# EAGLE design shield passage vitesse (EAGLE 9.2.1)
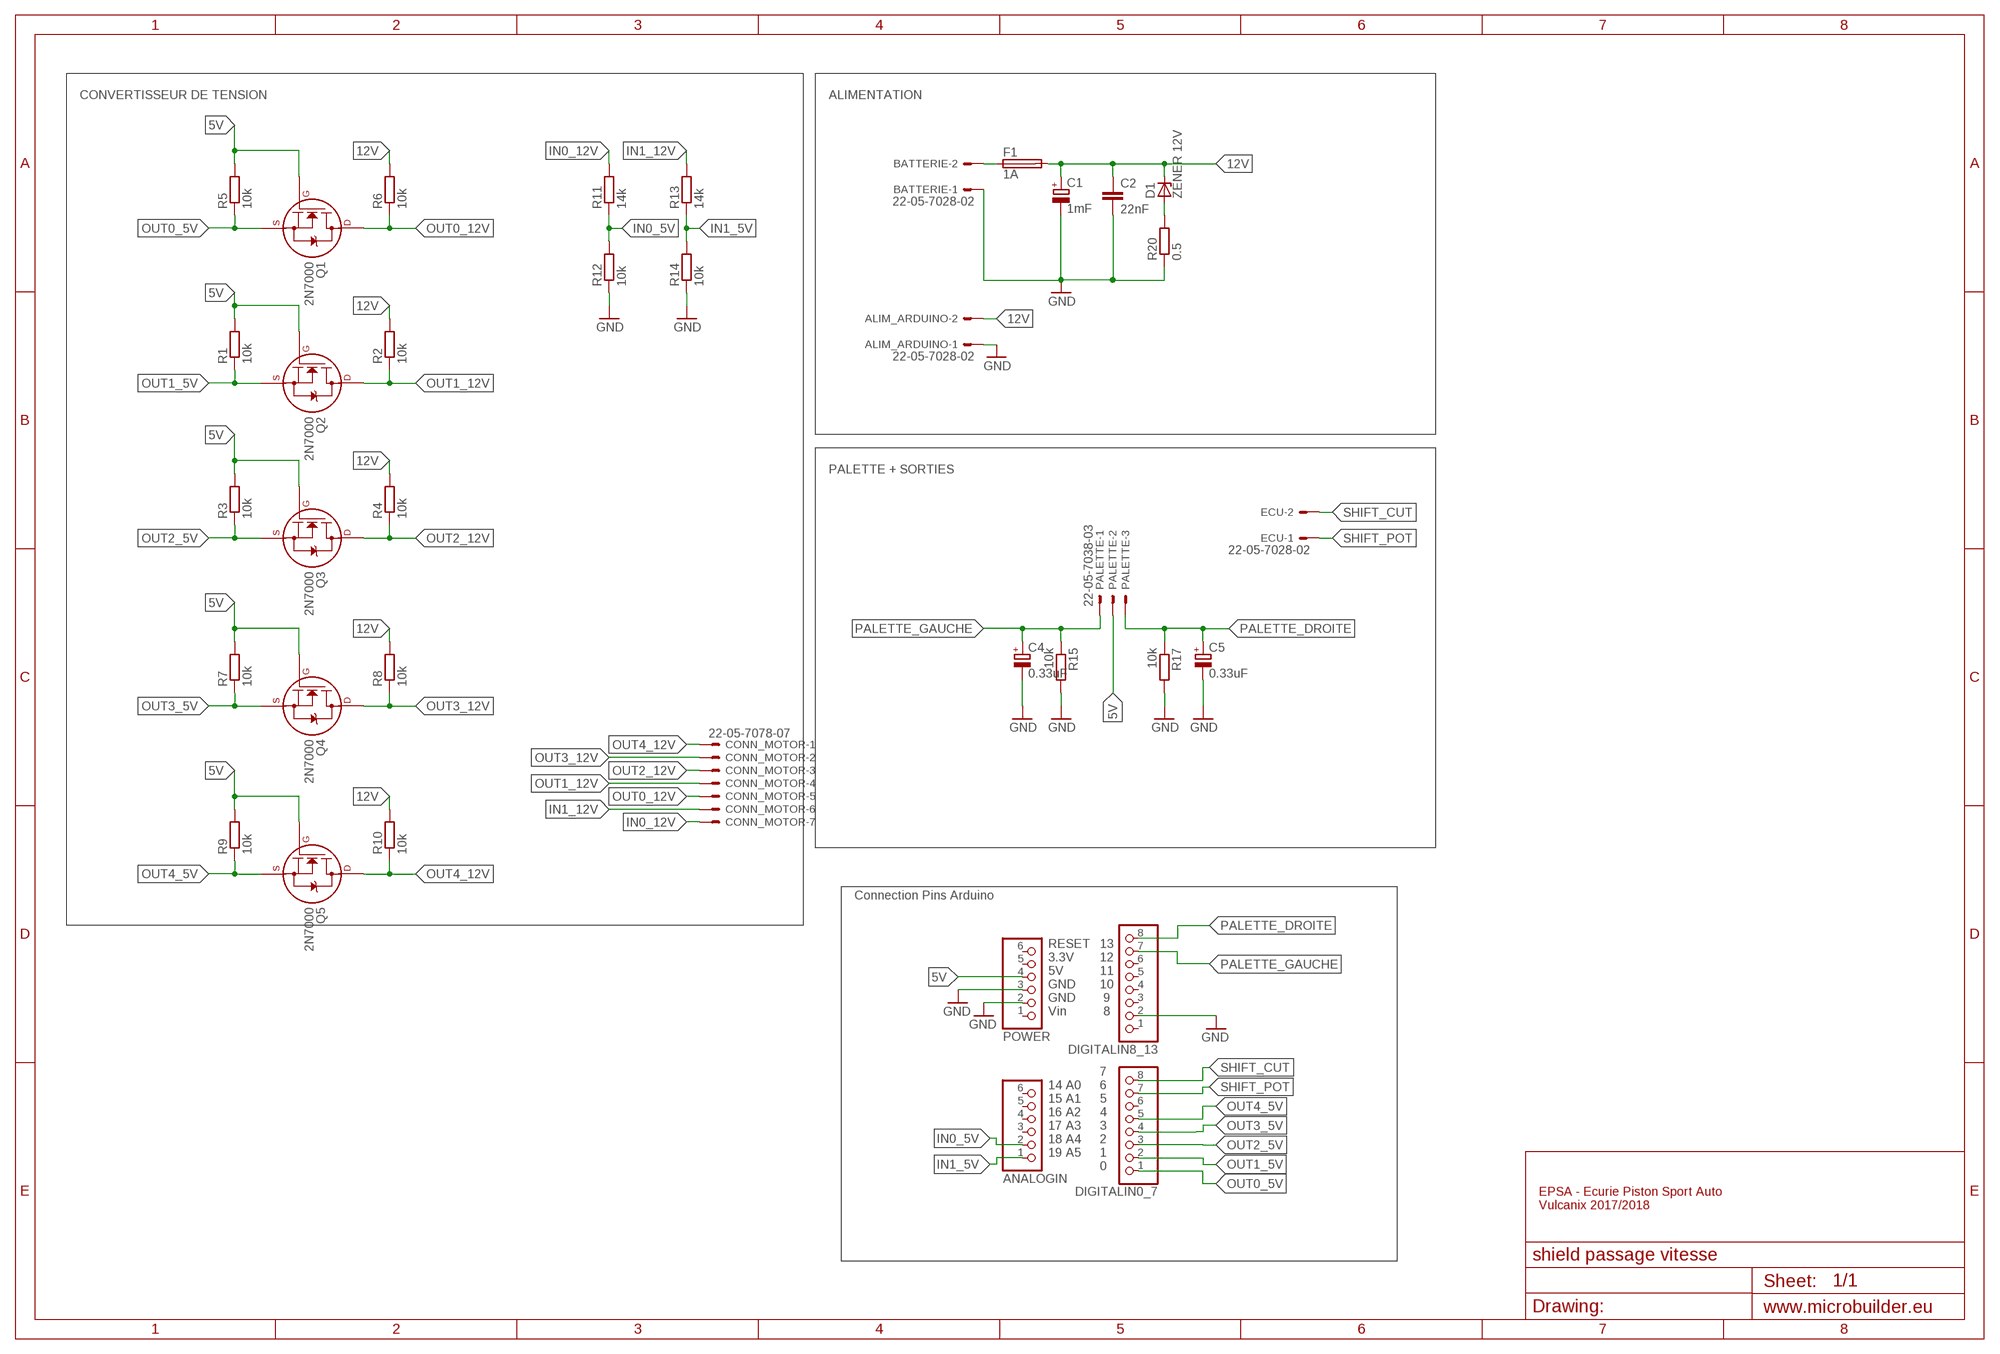
[diagram p0: schematic, sheet 1]

## Parts
ALIM_ARDUINO  22-05-7028-02  [7395-02]
ANALOGIN  PINHD-1X6CB  [1X06-CLEANBIG]
BATTERIE  22-05-7028-02  [7395-02]
C1  1mF  CPOL-EUE7.5-16  [E7,5-16]
C2  22nF  C-EU025-025X050  [C025-025X050]
C4  0.33uF  CPOL-EUE2,5-6E  [E2,5-6E]
C5  0.33uF  CPOL-EUE2,5-6E  [E2,5-6E]
CONN_MOTOR  22-05-7078-07  [7395-07]
D1  ZENER 12V  ZENER-DIODEDO41Z10  [DO41Z10]
DIGITALIN0_7  PINHD-1X8CLEANBIG  [1X08-CLEANBIG]
DIGITALIN8_13  PINHD-1X8CLEANBIG  [1X08-CLEANBIG]
ECU  22-05-7028-02  [7395-02]
F1  1A  SH25  [SH25]
PALETTE  22-05-7038-03  [7395-03]
POWER  PINHD-1X6CB  [1X06-CLEANBIG]
Q1  2N7000  2N7000_TO92  [TO-92]
Q2  2N7000  2N7000_TO92  [TO-92]
Q3  2N7000  2N7000_TO92  [TO-92]
Q4  2N7000  2N7000_TO92  [TO-92]
Q5  2N7000  2N7000_TO92  [TO-92]
R1  10k  R-EU_0204/7  [0204/7]
R2  10k  R-EU_0204/7  [0204/7]
R3  10k  R-EU_0204/7  [0204/7]
R4  10k  R-EU_0204/7  [0204/7]
R5  10k  R-EU_0204/7  [0204/7]
R6  10k  R-EU_0204/7  [0204/7]
R7  10k  R-EU_0204/7  [0204/7]
R8  10k  R-EU_0204/7  [0204/7]
R9  10k  R-EU_0204/7  [0204/7]
R10  10k  R-EU_0204/7  [0204/7]
R11  14k  R-EU_0204/7  [0204/7]
R12  10k  R-EU_0204/7  [0204/7]
R13  14k  R-EU_0204/7  [0204/7]
R14  10k  R-EU_0204/7  [0204/7]
R15  10k  R-EU_0204/7  [0204/7]
R17  10k  R-EU_0204/7  [0204/7]
R20  0.5  R-EU_0309/12  [0309/12]

## Nets
5V: PALETTE.2 POWER.4 Q1.2(G) Q2.2(G) Q3.2(G) Q4.2(G) Q5.2(G) R1.2 R3.2 R5.2 R7.2 R9.2
12V [Vcc12]: ALIM_ARDUINO.2 C1.+ C2.1 D1.C F1.2 R2.2 R4.2 R6.2 R8.2 R10.2
GND: ALIM_ARDUINO.1 BATTERIE.1 C1.- C2.2 C4.- C5.- DIGITALIN8_13.2 POWER.2 POWER.3 R12.1 R14.1 R15.2 R17.2 R20.1
IN0_5V: ANALOGIN.2 R11.1 R12.2
IN0_12V: CONN_MOTOR.7 R11.2
IN1_5V: ANALOGIN.1 R13.1 R14.2
IN1_12V: CONN_MOTOR.6 R13.2
N$1: BATTERIE.2 F1.1
N$4: D1.A R20.2
OUT0_5V: DIGITALIN0_7.1 Q1.1(S) R5.1
OUT0_12V: CONN_MOTOR.5 Q1.3(D) R6.1
OUT1_5V: DIGITALIN0_7.2 Q2.1(S) R1.1
OUT1_12V: CONN_MOTOR.4 Q2.3(D) R2.1
OUT2_5V: DIGITALIN0_7.3 Q3.1(S) R3.1
OUT2_12V: CONN_MOTOR.3 Q3.3(D) R4.1
OUT3_5V: DIGITALIN0_7.4 Q4.1(S) R7.1
OUT3_12V: CONN_MOTOR.2 Q4.3(D) R8.1
OUT4_5V: DIGITALIN0_7.5 Q5.1(S) R9.1
OUT4_12V: CONN_MOTOR.1 Q5.3(D) R10.1
PALETTE_DROITE: C5.+ DIGITALIN8_13.8 PALETTE.3 R17.1
PALETTE_GAUCHE: C4.+ DIGITALIN8_13.7 PALETTE.1 R15.1
SHIFT_CUT: DIGITALIN0_7.8 ECU.2
SHIFT_POT: DIGITALIN0_7.7 ECU.1
Unconnected: ANALOGIN.3 ANALOGIN.4 ANALOGIN.5 ANALOGIN.6 DIGITALIN0_7.6 DIGITALIN8_13.1 DIGITALIN8_13.3 DIGITALIN8_13.4 DIGITALIN8_13.5 DIGITALIN8_13.6 POWER.1 POWER.5 POWER.6

## Notes on the sheet
- CONVERTISSEUR DE TENSION | ALIMENTATION
- PALETTE + SORTIES
- Connection Pins Arduino
- RESET
  3.3V
  5V
  GND
  GND
  Vin
- 13
  12
  11
  10
   9
   8
- 14 A0
  15 A1
  16 A2
  17 A3
  18 A4
  19 A5
- 7
  6
  5
  4
  3
  2
  1
  0
- EPSA - Ecurie Piston Sport Auto
  Vulcanix 2017/2018

## Library data of the parts
ALIM_ARDUINO BATTERIE ECU = EP_molex_6410_7395:22-?-02: CONNECTOR wire to board 2.54 mm (.1 inch) pitch header
ANALOGIN POWER = carduino:PINHD-1X6: PIN HEADER
C1 C4 C5 = rcl:CPOL-EU: POLARIZED CAPACITOR, European symbol
C2 = rcl:C-EU: CAPACITOR, European symbol
CONN_MOTOR = EP_molex_6410_7395:22-?-07: CONNECTOR wire to board 2.54 mm (.1 inch) pitch header
D1 = diode:ZENER-DIODE: Z-Diode
DIGITALIN0_7 DIGITALIN8_13 = carduino:PINHD-1X8: PIN HEADER
F1 = fuse:SH25: FUSE HOLDER grid 25 mm, OGN0031 8211, Schurter (Buerklin); MF: SCHURTER; MPN: 0031.8211; OC_FARNELL: 1162741; OC_NEWARK: 96B9380
PALETTE = EP_molex_6410_7395:22-?-03: CONNECTOR wire to board 2.54 mm (.1 inch) pitch header
Q1-Q5 = transistors:2N700*: 2N7000, 2N7002, NDS7002A N-channel enhancement mode MOSFET
R1-R15 R17 R20 = resistor:R-EU_: RESISTOR, European symbol

## Net classes
0 default: width 0.61 mm
1 Vcc12: width 1.016 mm

## Board
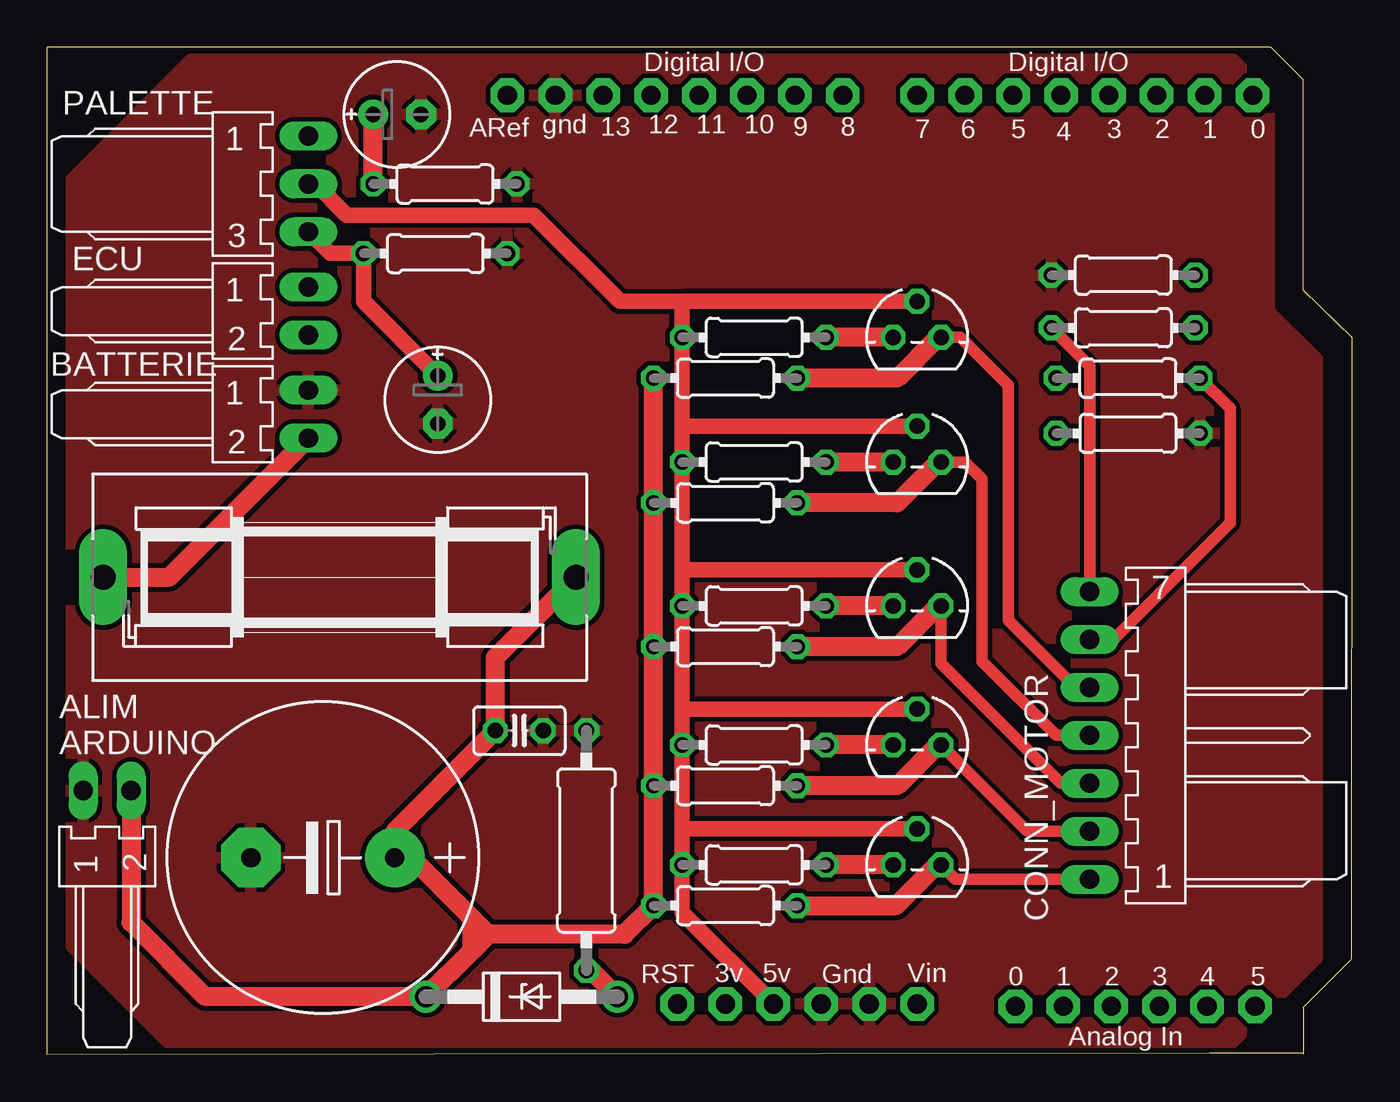
[diagram p1: board, top side]
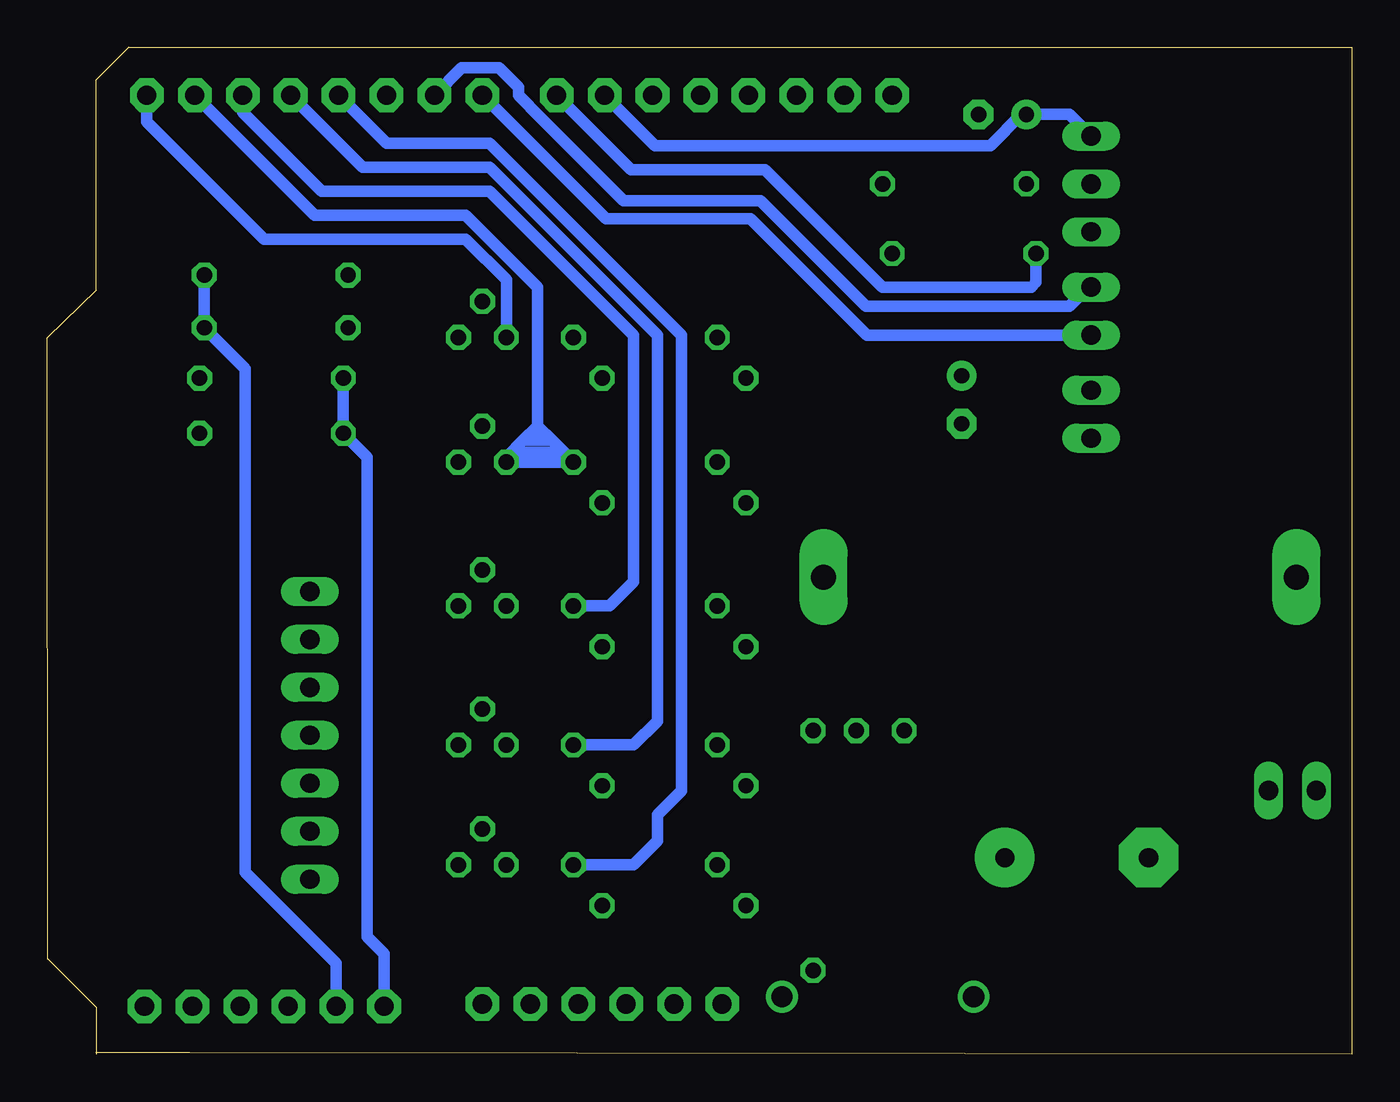
[diagram p2: board, bottom side, seen from below]

Size 69.16 x 53.35 mm. Coordinates in mm from the lower left corner, seen from the top.
Outline: 69.13,5.05 69.13,5.05
Outline: 69.13,5.05 69.16,37.95 66.55,40.49 66.55,51.63 64.83,53.35 0,53.35 0,0 61.6,0.09 66.58,0.08
Outline: 69.13,5.05 66.55,2.5 66.57,0
Copper layers (1*16): Top 0.035mm / dielectric 1.5mm / Bottom 0.035mm
Design rules "default *": minimum track width 10mil, minimum drill 19mil, track to track 10mil, track to pad 10mil, pad to pad 0mil, via to via 10mil, smd to smd 0mil, copper to edge 10mil, drill to drill 8mil, minimum pad ring 10mil, minimum via ring 8mil, stop-mask expansion 4mil, vias tented up to drill 0mil, thermal gap 10mil

### Footprints (pad centres in the part's own frame; a part is rotated, then mirrored left to right if it is on the bottom)
7395-02 = drill 1.016 long: 1 1.27,0; 2 -1.27,0
1X06-CLEANBIG = drill 1.016 pad 1.778 octagon: 1 -6.35,0; 2 -3.81,0; 3 -1.27,0; 4 1.27,0; 5 3.81,0; 6 6.35,0
E7,5-16 = drill 1.016 pad 3.15: + -3.81,0 | drill 1.016 pad 3.15 octagon: - 3.81,0
C025-025X050 = drill 0.813 octagon: 1 -1.27,0; 2 1.27,0
E2,5-6E = drill 0.813 pad 1.575: + -1.27,0 | drill 0.813 pad 1.575 octagon: - 1.27,0
7395-07 = drill 1.016 long: 1 7.62,0; 2 5.08,0; 3 2.54,0; 4 0,0; 5 -2.54,0; 6 -5.08,0; 7 -7.62,0
DO41Z10 = drill 1.118: A 5.08,0; C -5.08,0
1X08-CLEANBIG = drill 1.016 pad 1.778 octagon: 1 -8.89,0; 2 -6.35,0; 3 -3.81,0; 4 -1.27,0; 5 1.27,0; 6 3.81,0; 7 6.35,0; 8 8.89,0
SH25 = drill 1.321 pad 2.54 long: 1 -12.522,0; 2 12.522,0
7395-03 = drill 1.016 long: 1 2.54,0; 2 0,0; 3 -2.54,0
TO-92 = drill 0.813 octagon: 1 -1.27,0; 2 0,1.905; 3 1.27,0
0204/7 = drill 0.813 octagon: 1 -3.81,0; 2 3.81,0
0309/12 = drill 0.813 octagon: 1 -6.35,0; 2 6.35,0

### Placement (x,y rotation side)
ALIM_ARDUINO  3.17,13.98 180 top
ANALOGIN  57.65,2.55 0 top
BATTERIE  13.84,33.91 90 top
C1  14.6,10.42 180 top
C2  25.02,17.15 0 top
C4  18.54,49.79 0 top
C5  20.7,34.68 270 top
CONN_MOTOR  55.24,16.9 270 top
D1  25.14,3.05 0 top
DIGITALIN0_7  54.99,50.81 180 top
DIGITALIN8_13  33.27,50.81 0 top
ECU  13.84,39.38 90 top
F1  15.49,25.28 0 top
PALETTE  13.84,46.11 90 top
POWER  39.75,2.67 180 top
Q1  46.1,37.98 0 top
Q2  46.1,31.37 0 top
Q3  46.1,23.75 0 top
Q4  46.1,16.39 0 top
Q5  46.1,10.04 0 top
R1  37.46,31.37 180 top
R2  35.94,29.22 180 top
R3  37.46,23.75 180 top
R4  35.94,21.6 180 top
R5  37.46,37.98 180 top
R6  35.94,35.82 180 top
R7  37.46,16.39 180 top
R8  35.94,14.23 180 top
R9  37.46,10.04 180 top
R10  35.94,7.88 180 top
R11  57.02,38.49 180 top
R12  57.02,41.28 0 top
R13  57.27,35.82 0 top
R14  57.27,32.9 180 top
R15  21.08,46.11 0 top
R17  20.57,42.42 0 top
R20  28.57,10.8 270 top

### Tracks (layer width: path | path; a pad name or v marks a point on that pad's centre or on a via)
5V
  Top 0.813: Q1.2 33.65,39.88 | 33.65,33.03 R5.2 33.65,39.88 | 33.65,33.03 R1.2 33.65,25.41 | 33.65,25.41 R3.2 33.65,18.42 | 33.65,18.42 R7.2 33.65,12.07 | 33.65,12.07 R9.2 33.65,7.5 POWER.4 | 33.65,39.88 30.35,39.88 25.78,44.46 15.87,44.46 14.22,46.11 PALETTE.2 | 33.65,25.41 33.91,25.66 Q3.2 | 33.65,18.42 33.78,18.29 Q4.2 | 33.65,12.07 33.78,11.94 Q5.2 | 33.65,33.03 33.91,33.28 Q2.2
12V
  Top 1.016: ALIM_ARDUINO.2 4.44,6.99 8.38,3.05 D1.C 22.48,5.47 | 28.19,25.1 F1.2 23.75,21.01 C2.1 18.41,11.82 C1.+ 18.41,10.8 18.92,10.8 22.48,7.24 | R6.2 R2.2 R4.2 R8.2 R10.2 30.6,6.36 23.36,6.36 | 23.36,6.36 22.48,5.47 | 23.36,6.36 22.48,7.24 | 22.48,7.24 22.48,5.47
GND
  pour Top: 6.35,0.64 1.27,5.72 1.27,46.36 7.62,52.71 62.86,52.71 64.77,50.81 64.77,39.38 67.31,36.84 67.31,5.09 62.86,0.64
IN0_5V
  Bottom 0.61: ANALOGIN.2 53.84,4.83 58.67,9.66 58.67,36.33 R11.1 R12.2
IN0_12V
  Top 0.61: R11.2 55.24,36.45 CONN_MOTOR.7
IN1_5V
  Bottom 0.61: R13.1 R14.2 52.19,31.63 52.19,6.23 51.3,5.34 ANALOGIN.1
IN1_12V
  Top 0.61: CONN_MOTOR.6 56.51,21.98 62.68,28.15 62.68,34.22 R13.2
N$1
  Top 1.016: BATTERIE.2 6.47,25.28 F1.1
N$4
  Top 1.016: D1.A 28.83,4.45 R20.2
OUT0_5V
  Top 1.016: Q1.1 R5.1
  Bottom 0.61: DIGITALIN0_7.1 63.88,49.41 57.65,43.19 46.99,43.19 44.83,41.03 Q1.1
OUT0_12V
  Top 0.61: CONN_MOTOR.5 54.48,19.44 50.92,22.99 50.92,35.44 48.38,37.98 Q1.3
  Top 1.016: R6.1 45.04,35.82 47.2,37.98 Q1.3
OUT1_5V
  Top 1.016: Q2.1 R1.1
  Bottom 0.61: DIGITALIN0_7.2 54.99,44.46 46.99,44.46 43.18,40.65 43.18,33.28 | 41.78,31.88 R1.1 44.57,31.37 44.83,31.63 | 42.41,32.52 43.18,33.28 | 43.18,33.28 43.94,32.52 | 43.94,32.52 44.83,31.63 | 44.83,31.63 Q2.1 44.32,31.88 41.78,31.88 | 41.78,31.88 42.41,32.52 | 42.41,32.52 43.94,32.52
OUT1_12V
  Top 0.61: Q2.3 48.64,31.37 49.53,30.49 49.53,20.83 53.46,16.9 CONN_MOTOR.4
  Top 1.016: R2.1 45.04,29.22 47.2,31.37 Q2.3
OUT2_5V
  Top 1.016: Q3.1 R3.1
  Bottom 0.61: DIGITALIN0_7.3 58.8,49.92 54.61,45.73 45.72,45.73 38.1,38.11 38.1,25.02 39.37,23.75 R3.1
OUT2_12V
  Top 0.61: Q3.3 47.37,20.71 53.72,14.36 CONN_MOTOR.3
  Top 1.016: R4.1 45.04,21.6 47.2,23.75 Q3.3
OUT3_5V
  Top 1.016: Q4.1 R7.1
  Bottom 0.61: DIGITALIN0_7.4 52.45,47 45.72,47 36.83,38.11 36.83,17.66 38.1,16.39 R7.1
OUT3_12V
  Top 0.61: Q4.3 51.94,11.82 CONN_MOTOR.2
  Top 1.016: R8.1 45.04,14.23 47.2,16.39 Q4.3
  Bottom 0.61: Q4.3 47.49,16.26
OUT4_5V
  Top 1.016: Q5.1 R9.1
  Bottom 0.61: DIGITALIN0_7.5 51.18,48.27 45.72,48.27 35.56,38.11 35.56,13.98 36.83,12.71 36.83,11.31 38.1,10.04 R9.1
OUT4_12V
  Top 0.61: CONN_MOTOR.1 48.13,9.28 Q5.3
  Top 1.016: R10.1 44.98,7.88 47.14,10.04 Q5.3
PALETTE_DROITE
  Top 0.813: PALETTE.3 14.98,42.42 R17.1 16.76,39.88 C5.+
  Bottom 0.61: DIGITALIN8_13.8 38.22,46.87 31.11,46.87 24.89,40.65 17.01,40.65 16.76,40.9 R17.1
PALETTE_GAUCHE
  Top 1.016: R15.1 C4.+
  Bottom 0.61: DIGITALIN8_13.7 36.95,48.14 19.17,48.14 17.52,49.79 C4.+ 14.98,49.79 PALETTE.1
SHIFT_CUT
  Bottom 0.61: DIGITALIN0_7.8 39.56,44.27 31.89,44.27 25.73,38.11 ECU.2
SHIFT_POT
  Bottom 0.61: DIGITALIN0_7.7 47.19,52.25 45.21,52.25 44.19,51.24 44.19,50.81 43.61,50.22 43.61,50.21 38.62,45.22 31.37,45.22 25.78,39.63 14.98,39.63 13.97,40.65 ECU.1

### Text on the board
tPlace: Digital I/O | Digital I/O | ARef | gnd | 13 | 12 | 11 | 10 | 9 | 8 | 7 | 6 | 5 | 3 | 2 | 1 | 0 | 4 | RST | 3v | 5v | Vin | Gnd | 0 | 1 | 2 | 3 | 4 | 5 | Analog In
tNames: ALIM / ARDUINO